# Altium project Main_board.PrjPcb
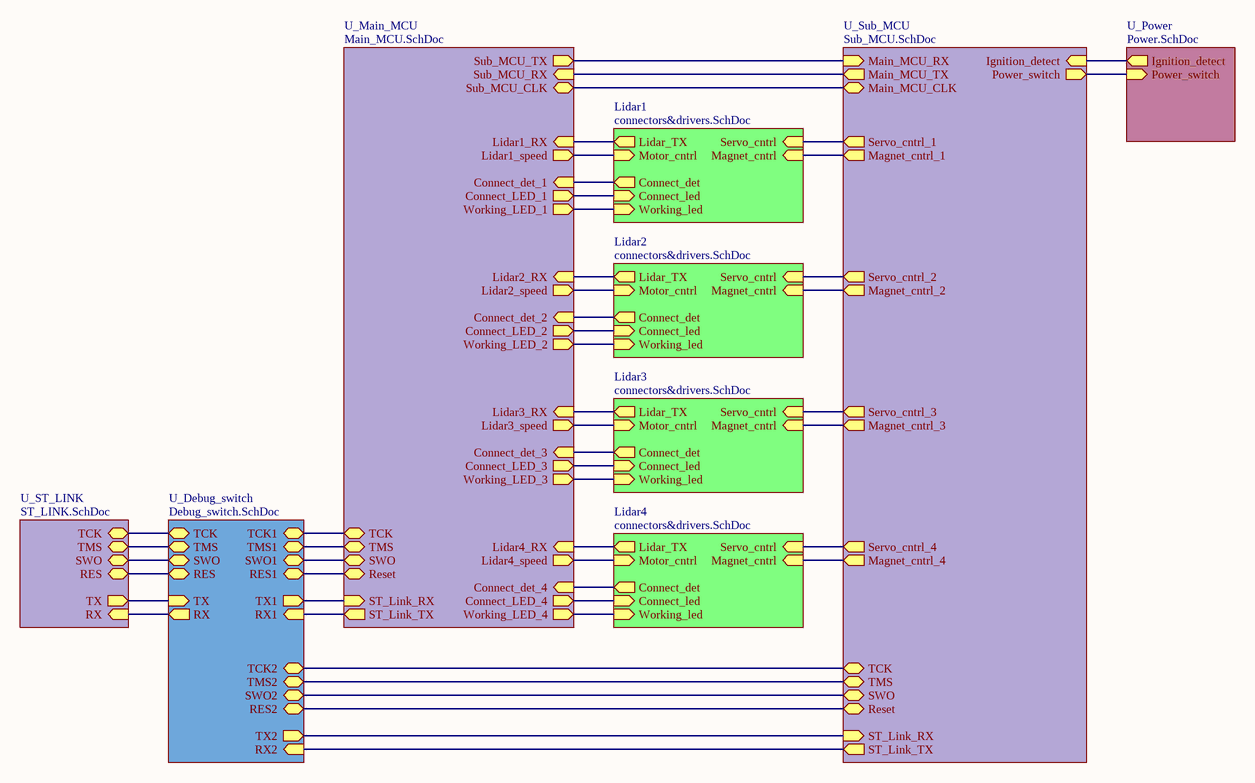
[diagram p0: Main_scheme.SchDoc]
7 sheets, 306 parts. Net scope: hierarchical (ports join the sheet entries above them; power ports are global).
Board file: PCB1.PcbDoc
Sheets:
  Main_scheme.SchDoc
    Lidar1 = connectors&drivers.SchDoc
    Lidar2 = connectors&drivers.SchDoc
    Lidar3 = connectors&drivers.SchDoc
    Lidar4 = connectors&drivers.SchDoc
    U_Main_MCU = Main_MCU.SchDoc
    U_Debug_switch = Debug_switch.SchDoc
    U_ST_LINK = ST_LINK.SchDoc
    U_Sub_MCU = Sub_MCU.SchDoc
    U_Power = Power.SchDoc

## Sheet Main_scheme.SchDoc
size A4; SheetNumber: 1; SheetTotal: 7

### Sub-sheets
Lidar1 = connectors&drivers.SchDoc: Servo_cntrl (in), Motor_cntrl (in), Magnet_cntrl (in), Lidar_TX (out), Connect_det (out), Connect_led (in), Working_led (in)
Lidar2 = connectors&drivers.SchDoc: Servo_cntrl (in), Motor_cntrl (in), Magnet_cntrl (in), Lidar_TX (out), Connect_det (out), Connect_led (in), Working_led (in)
Lidar3 = connectors&drivers.SchDoc: Servo_cntrl (in), Motor_cntrl (in), Magnet_cntrl (in), Lidar_TX (out), Connect_det (out), Connect_led (in), Working_led (in)
Lidar4 = connectors&drivers.SchDoc: Servo_cntrl (in), Motor_cntrl (in), Magnet_cntrl (in), Lidar_TX (out), Connect_det (out), Connect_led (in), Working_led (in)
U_Debug_switch = Debug_switch.SchDoc: SWO (bidir), RES (bidir), TMS (bidir), TCK (bidir), SWO1 (bidir), RES1 (bidir), SWO2 (bidir), RES2 (bidir), TMS1 (bidir), TCK1 (bidir), TMS2 (bidir), TCK2 (bidir), TX1 (out), RX1 (in), TX2 (out), RX2 (in), TX (in), RX (out)
U_Main_MCU = Main_MCU.SchDoc: TMS (bidir), TCK (bidir), SWO (bidir), Reset (bidir), Lidar1_RX (in), ST_Link_RX (in), ST_Link_TX (out), Lidar2_RX (in), Lidar3_RX (in), Lidar4_RX (in), Sub_MCU_RX (in), Sub_MCU_TX (out), Lidar1_speed (out), Lidar2_speed (out), Lidar4_speed (out), Lidar3_speed (out), Connect_det_1 (in), Connect_LED_1 (out), Working_LED_1 (out), Connect_det_2 (in), Connect_LED_2 (out), Working_LED_2 (out), Connect_det_3 (in), Connect_LED_3 (out), Working_LED_3 (out), Connect_det_4 (in), Connect_LED_4 (out), Working_LED_4 (out), Sub_MCU_CLK (bidir)
U_Power = Power.SchDoc: Ignition_detect (out), Power_switch (in)
U_ST_LINK = ST_LINK.SchDoc: SWO (bidir), RES (bidir), TMS (bidir), TCK (bidir), TX (out), RX (in)
U_Sub_MCU = Sub_MCU.SchDoc: TMS (bidir), TCK (bidir), SWO (bidir), Reset (bidir), Servo_cntrl_1 (out), Servo_cntrl_2 (out), Servo_cntrl_3 (out), Servo_cntrl_4 (out), Magnet_cntrl_1 (out), Magnet_cntrl_2 (out), Magnet_cntrl_3 (out), Magnet_cntrl_4 (out), ST_Link_RX (in), ST_Link_TX (out), Main_MCU_RX (in), Main_MCU_TX (out), Main_MCU_CLK (bidir), Ignition_detect (in), Power_switch (out)

### Nets
Connect_det_1: sheet Lidar1/Connect_det, sheet U_Main_MCU/Connect_det_1
Connect_det_2: sheet Lidar2/Connect_det, sheet U_Main_MCU/Connect_det_2
Connect_det_3: sheet Lidar3/Connect_det, sheet U_Main_MCU/Connect_det_3
Connect_det_4: sheet Lidar4/Connect_det, sheet U_Main_MCU/Connect_det_4
Connect_LED_1: sheet Lidar1/Connect_led, sheet U_Main_MCU/Connect_LED_1
Connect_LED_2: sheet Lidar2/Connect_led, sheet U_Main_MCU/Connect_LED_2
Connect_LED_3: sheet Lidar3/Connect_led, sheet U_Main_MCU/Connect_LED_3
Connect_LED_4: sheet Lidar4/Connect_led, sheet U_Main_MCU/Connect_LED_4
Ignition_detect: sheet U_Sub_MCU/Ignition_detect, sheet U_Power/Ignition_detect
Lidar1_RX: sheet Lidar1/Lidar_TX, sheet U_Main_MCU/Lidar1_RX
Lidar1_speed: sheet Lidar1/Motor_cntrl, sheet U_Main_MCU/Lidar1_speed
Lidar2_RX: sheet Lidar2/Lidar_TX, sheet U_Main_MCU/Lidar2_RX
Lidar2_speed: sheet Lidar2/Motor_cntrl, sheet U_Main_MCU/Lidar2_speed
Lidar3_RX: sheet Lidar3/Lidar_TX, sheet U_Main_MCU/Lidar3_RX
Lidar3_speed: sheet Lidar3/Motor_cntrl, sheet U_Main_MCU/Lidar3_speed
Lidar4_RX: sheet Lidar4/Lidar_TX, sheet U_Main_MCU/Lidar4_RX
Lidar4_speed: sheet Lidar4/Motor_cntrl, sheet U_Main_MCU/Lidar4_speed
Main_debug_RX: sheet U_Debug_switch/RX, sheet U_ST_LINK/RX
Main_debug_TX: sheet U_Debug_switch/TX, sheet U_ST_LINK/TX
Main_MCU_debug_RX: sheet U_Main_MCU/ST_Link_RX, sheet U_Debug_switch/TX1
Main_MCU_debug_TX: sheet U_Main_MCU/ST_Link_TX, sheet U_Debug_switch/RX1
Main_MCU_reset: sheet U_Main_MCU/Reset, sheet U_Debug_switch/RES1
Main_MCU_SWO: sheet U_Main_MCU/SWO, sheet U_Debug_switch/SWO1
Main_MCU_TCK: sheet U_Main_MCU/TCK, sheet U_Debug_switch/TCK1
Main_MCU_TMS: sheet U_Main_MCU/TMS, sheet U_Debug_switch/TMS1
Main_RES: sheet U_Debug_switch/RES, sheet U_ST_LINK/RES
Main_SWO: sheet U_Debug_switch/SWO, sheet U_ST_LINK/SWO
Main_TCK: sheet U_Debug_switch/TCK, sheet U_ST_LINK/TCK
Main_TMS: sheet U_Debug_switch/TMS, sheet U_ST_LINK/TMS
Power_switch: sheet U_Sub_MCU/Power_switch, sheet U_Power/Power_switch
Sub_MCU_CLK: sheet U_Main_MCU/Sub_MCU_CLK, sheet U_Sub_MCU/Main_MCU_CLK
Sub_MCU_debug_RX: sheet U_Debug_switch/TX2, sheet U_Sub_MCU/ST_Link_RX
Sub_MCU_debug_TX: sheet U_Debug_switch/RX2, sheet U_Sub_MCU/ST_Link_TX
Sub_MCU_RES: sheet U_Debug_switch/RES2, sheet U_Sub_MCU/Reset
Sub_MCU_RX: sheet U_Main_MCU/Sub_MCU_RX, sheet U_Sub_MCU/Main_MCU_TX
Sub_MCU_SWO: sheet U_Debug_switch/SWO2, sheet U_Sub_MCU/SWO
Sub_MCU_TCK: sheet U_Debug_switch/TCK2, sheet U_Sub_MCU/TCK
Sub_MCU_TMS: sheet U_Debug_switch/TMS2, sheet U_Sub_MCU/TMS
Sub_MCU_TX: sheet U_Main_MCU/Sub_MCU_TX, sheet U_Sub_MCU/Main_MCU_RX
Working_LED_1: sheet Lidar1/Working_led, sheet U_Main_MCU/Working_LED_1
Working_LED_2: sheet Lidar2/Working_led, sheet U_Main_MCU/Working_LED_2
Working_LED_3: sheet Lidar3/Working_led, sheet U_Main_MCU/Working_LED_3
Working_LED_4: sheet Lidar4/Working_led, sheet U_Main_MCU/Working_LED_4
NetIC601_1_2: sheet Lidar1/Servo_cntrl, sheet U_Sub_MCU/Servo_cntrl_1
NetIC601_2_2: sheet Lidar2/Servo_cntrl, sheet U_Sub_MCU/Servo_cntrl_2
NetIC601_3_2: sheet Lidar3/Servo_cntrl, sheet U_Sub_MCU/Servo_cntrl_3
NetIC601_4_2: sheet Lidar4/Servo_cntrl, sheet U_Sub_MCU/Servo_cntrl_4
NetU300_18: sheet Lidar3/Magnet_cntrl, sheet U_Sub_MCU/Magnet_cntrl_3
NetU300_19: sheet Lidar4/Magnet_cntrl, sheet U_Sub_MCU/Magnet_cntrl_4
NetU300_40: sheet Lidar1/Magnet_cntrl, sheet U_Sub_MCU/Magnet_cntrl_1
NetU300_41: sheet Lidar2/Magnet_cntrl, sheet U_Sub_MCU/Magnet_cntrl_2

## Sheet connectors&drivers.SchDoc
size A4; SheetNumber: 7; SheetTotal: 7
Used 4 times, as channels Lidar1, Lidar2, Lidar3, Lidar4. Parts and nets are listed once, with the designators drawn on the sheet.
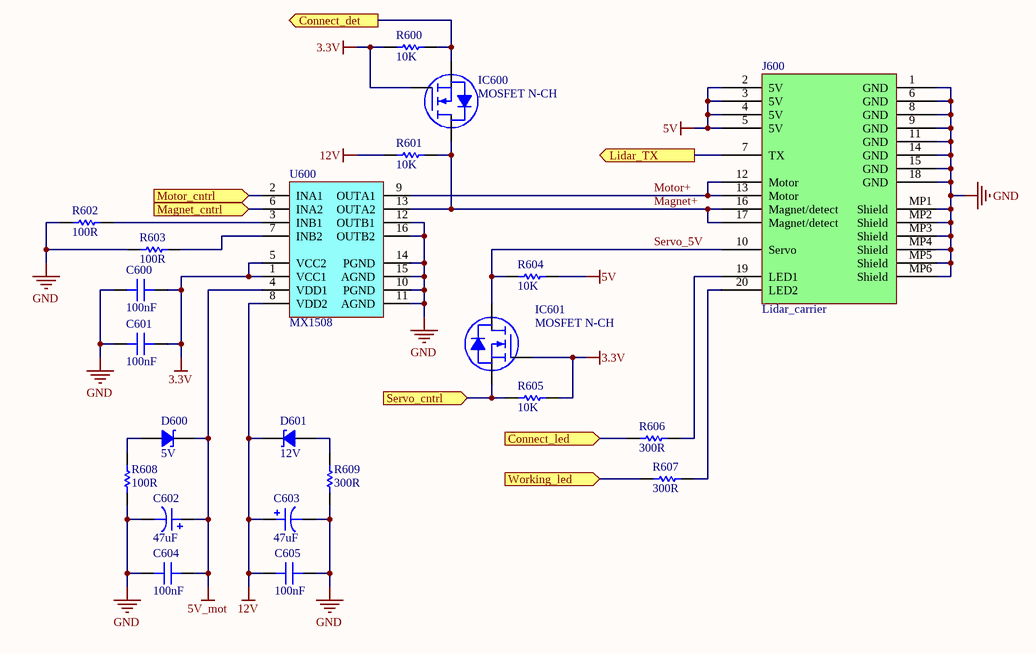
[diagram p1: connectors&drivers.SchDoc]

### Parts
C600  100nF  [CAP 0603]
C601  100nF  [CAP 0603]
C602  47uF  [CAP ALSMD ELEC 6.6MM H5.7MM]
C603  47uF  [CAP ALSMD ELEC 6.6MM H5.7MM]
C604  100nF  [CAP 0603]
C605  100nF  [CAP 0603]
D600  5V  [Bourns DO214AC SMA]
D601  12V  [Bourns DO214AC SMA]
IC600  MOSFET N-CH  [SOT-23]
IC601  MOSFET N-CH  [SOT-23]
J600  Lidar_carrier  [2167010209]
R600  10K  [RES 0603]
R601  10K  [RES 0603]
R602  100R  [RES 0603]
R603  100R  [RES 0603]
R604  10K  [RES 0603]
R605  10K  [RES 0603]
R606  300R  [RES 0603]
R607  300R  [RES 0603]
R608  100R  [RES 1206]
R609  300R  [RES 1206]
U600  MX1508  [TI SOP-16 D]

### Ports
Connect_det (out, see Main_scheme[2B]), Connect_led (in, see Main_scheme[2B]), Lidar_TX (out, see Main_scheme[2A]), Magnet_cntrl (in, see Main_scheme[3A]), Motor_cntrl (in, see Main_scheme[2A]), Servo_cntrl (in, see Main_scheme[3A]), Working_led (in, see Main_scheme[2B])

### Nets
3.3V: C600.2 C601.2 IC600.1(G) IC601.1(G) R600.2 R605.1 U600.1(VCC1) U600.5(VCC2)
5V: J600.2(5V) J600.3(5V) J600.4(5V) J600.5(5V) R604.1
5V_mot: C602.2 C604.2 D600.2 U600.4(VDD1)
12V: C603.2 C605.1 D601.2 R601.2 U600.8(VDD2)
GND: C600.1 C601.1 C602.1 C603.1 C604.1 C605.2 J600.1(GND) J600.6(GND) J600.8(GND) J600.9(GND) J600.11(GND) J600.14(GND) J600.15(GND) J600.18(GND) J600.MP1(Shield) J600.MP2(Shield) J600.MP3(Shield) J600.MP4(Shield) J600.MP5(Shield) J600.MP6(Shield) R602.1 R603.1 R608.1 R609.1 U600.10(PGND) U600.11(AGND) U600.12(OUTB1) U600.14(PGND) U600.15(AGND) U600.16(OUTB2)
Connect_det: IC600.2(S) R600.1 ; port Connect_det
Connect_led: R606.2 ; port Connect_led
Lidar_TX: J600.7(TX) ; port Lidar_TX
Magnet+: IC600.3(D) J600.16(Magnet/detect) J600.17(Magnet/detect) R601.1 U600.13(OUTA2)
Magnet_cntrl: U600.6(INA2) ; port Magnet_cntrl
Motor+: J600.12(Motor) J600.13(Motor) U600.9(OUTA1)
Motor_cntrl: U600.2(INA1) ; port Motor_cntrl
Servo_5V: IC601.3(D) J600.10(Servo) R604.2
Servo_cntrl: IC601.2(S) R605.2 ; port Servo_cntrl
Working_led: R607.2 ; port Working_led
NetD600_1: D600.1 R608.2
NetD601_1: D601.1 R609.2
NetJ600_19: J600.19(LED1) R606.1
NetJ600_20: J600.20(LED2) R607.1
NetR602_2: R602.2 U600.3(INB1)
NetR603_2: R603.2 U600.7(INB2)

### Channels
Lidar1: designators end in _1; ports Connect_det=Connect_det_1 Connect_led=Connect_LED_1 Lidar_TX=Lidar1_RX Magnet_cntrl=NetU300_40 Motor_cntrl=Lidar1_speed Servo_cntrl=NetIC601_1_2 Working_led=Working_LED_1
Lidar2: designators end in _2; ports Connect_det=Connect_det_2 Connect_led=Connect_LED_2 Lidar_TX=Lidar2_RX Magnet_cntrl=NetU300_41 Motor_cntrl=Lidar2_speed Servo_cntrl=NetIC601_2_2 Working_led=Working_LED_2
Lidar3: designators end in _3; ports Connect_det=Connect_det_3 Connect_led=Connect_LED_3 Lidar_TX=Lidar3_RX Magnet_cntrl=NetU300_18 Motor_cntrl=Lidar3_speed Servo_cntrl=NetIC601_3_2 Working_led=Working_LED_3
Lidar4: designators end in _4; ports Connect_det=Connect_det_4 Connect_led=Connect_LED_4 Lidar_TX=Lidar4_RX Magnet_cntrl=NetU300_19 Motor_cntrl=Lidar4_speed Servo_cntrl=NetIC601_4_2 Working_led=Working_LED_4

### Library data of the parts
C600 C601 C604 C605 = Capacitor: SMT Capacitor; Value: 100nF
C602 C603 = Capacitor polarized: SMT Polarised Capacitor; Value: 47uF
D600 D601 = Diode Zener: Zener Diode
  D600: Value: 5V
  D601: Value: 12V
R600-R609 = Res: Resistor; Ordered by: Subcon; Published: 8-Jun-2000; Revision: July-2002: Re-released for DXP Platform.; Publisher: Altium Limited
  R600 R601 R604 R605: Value: 10K
  R602 R603 R608: Value: 100R
  R606 R607 R609: Value: 300R

## Sheet Main_MCU.SchDoc
size A4; SheetNumber: 3; SheetTotal: 7
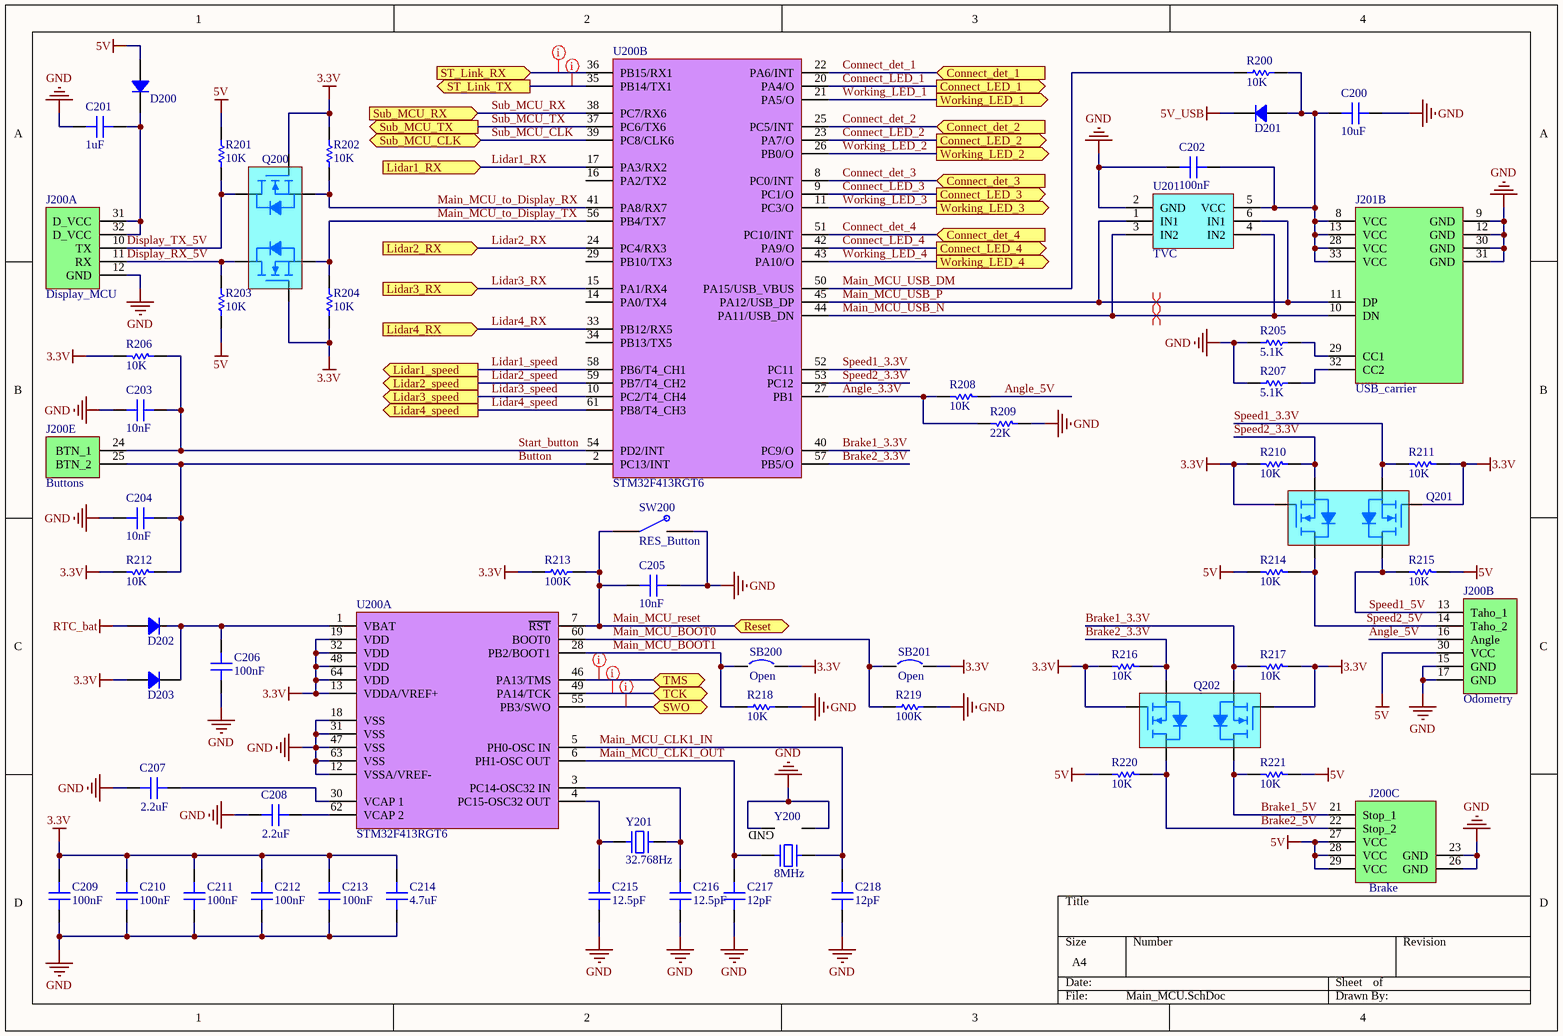
[diagram p2: Main_MCU.SchDoc]

### Parts
C200  10uF  [CAP 0603]
C201  1uF  [CAP 0603]
C202  100nF  [CAP 0603]
C203  10nF  [CAP 0603]
C204  10nF  [CAP 0603]
C205  10nF  [CAP 0603]
C206  100nF  [CAP 0603]
C207  2.2uF  [CAP 0603]
C208  2.2uF  [CAP 0603]
C209  100nF  [CAP 0603]
C210  100nF  [CAP 0603]
C211  100nF  [CAP 0603]
C212  100nF  [CAP 0603]
C213  100nF  [CAP 0603]
C214  4.7uF  [CAP 1206]
C215  12.5pF  [CAP 0603]
C216  12.5pF  [CAP 0603]
C217  12pF  [CAP 0603]
C218  12pF  [CAP 0603]
D200  (no value)  [Bourns DO214AC SMA - duplicate]
D201  (no value)  [Bourns DO214AC SMA - duplicate]
D202  (no value)  [SOD323HP]
D203  (no value)  [SOD323HP]
J200  Display_MCU  [2167010409]  (parts A,B,C,E of 6)
J201  USB_carrier  [2167010409]  (part B of 4)
Q200  Double N mos  [TI SOT-563 DRL]  (value not drawn)
Q201  Double N mos  [TI SOT-563 DRL]  (value not drawn)
Q202  Double N mos  [TI SOT-563 DRL]  (value not drawn)
R200  10K  [RES 0603]
R201  10K  [RES 0603]
R202  10K  [RES 0603]
R203  10K  [RES 0603]
R204  10K  [RES 0603]
R205  5.1K  [RES 0603]
R206  10K  [RES 0603]
R207  5.1K  [RES 0603]
R208  10K  [RES 0603]
R209  22K  [RES 0603]
R210  10K  [RES 0603]
R211  10K  [RES 0603]
R212  10K  [RES 0603]
R213  100K  [RES 0603]
R214  10K  [RES 0603]
R215  10K  [RES 0603]
R216  10K  [RES 0603]
R217  10K  [RES 0603]
R218  10K  [RES 0603]
R219  100K  [RES 0603]
R220  10K  [RES 0603]
R221  10K  [RES 0603]
SB200  Open  [SB_0603]
SB201  Open  [SB_0603]
SW200  RES_Button  [PTS636SM50JSMTRLFS]
U200  STM32F413RGT6  [QFP50P1200X1200X165-64N]  (parts A,B of 2)
U201  TVC  [DIODES SOT-23-6 W6]
Y200  8MHz  [XTAL_ECS-80-10-33-CHN-TR3]
Y201  32.768Hz  [Crystal_32.768]

### Ports
Connect_det_1 (in, see Main_scheme[2B]), Connect_det_2 (in, see Main_scheme[2B]), Connect_det_3 (in, see Main_scheme[2C]), Connect_det_4 (in, see Main_scheme[2C]), Connect_LED_1 (out, see Main_scheme[2B]), Connect_LED_2 (out, see Main_scheme[2B]), Connect_LED_3 (out, see Main_scheme[2C]), Connect_LED_4 (out, see Main_scheme[2C]), Lidar1_RX (in, see Main_scheme[2A]), Lidar1_speed (out, see Main_scheme[2A]), Lidar2_RX (in, see Main_scheme[2B]), Lidar2_speed (out, see Main_scheme[2B]), Lidar3_RX (in, see Main_scheme[2B]), Lidar3_speed (out, see Main_scheme[2C]), Lidar4_RX (in, see Main_scheme[2C]), Lidar4_speed (out, see Main_scheme[2C]), Reset (bidir, see Main_scheme[1C]), ST_Link_RX (in, see Main_scheme[1C]), ST_Link_TX (out, see Main_scheme[1C]), Sub_MCU_CLK (bidir, see Main_scheme[2A]), Sub_MCU_RX (in, see Main_scheme[2A]), Sub_MCU_TX (out, see Main_scheme[2A]), SWO (bidir, see Main_scheme[1C]), TCK (bidir, see Main_scheme[1C]), TMS (bidir, see Main_scheme[1C]), Working_LED_1 (out, see Main_scheme[2B]), Working_LED_2 (out, see Main_scheme[2B]), Working_LED_3 (out, see Main_scheme[2C]), Working_LED_4 (out, see Main_scheme[2C])

### Nets
3.3V: C209.2 C210.2 C211.2 C212.2 C213.2 C214.2 D203.1 Q200.1(G2) Q200.4(G1) Q201.1(G2) Q201.4(G1) Q202.1(G2) Q202.4(G1) R202.2 R204.1 R206.1 R210.1 R211.2 R212.1 R213.2 R216.1 R217.2 SB200.2 SB201.2 U200.13(VDDA/VREF+) U200.19(VDD) U200.32(VDD) U200.48(VDD) U200.64(VDD)
5V: D200.1 J200.27(VCC) J200.28(VCC) J200.29(VCC) J200.30(VCC) R201.2 R203.1 R214.1 R215.2 R220.1 R221.2
5V_USB: D201.2
GND: C200.2 C201.1 C202.1 C203.2 C204.2 C205.2 C206.1 C207.2 C208.2 C209.1 C210.1 C211.1 C212.1 C213.1 C214.1 C215.1 C216.1 C217.1 C218.1 J200.12(GND) J200.15(GND) J200.17(GND) J200.23(GND) J200.26(GND) J201.9(GND) J201.12(GND) J201.30(GND) J201.31(GND) R205.1 R207.1 R209.2 R218.1 R219.1 SW200.2 U200.12(VSSA/VREF-) U200.18(VSS) U200.31(VSS) U200.47(VSS) U200.63(VSS) U201.2(GND) Y200.2(GND) Y200.4(GND)
RTC_bat: D202.1
Angle_3.3V: R208.1 R209.1 U200.27(PB1)
Angle_5V: J200.16(Angle) R208.2
Brake1_3.3V: Q202.5(S1) R217.1 U200.40(PC9/O)
Brake1_5V: J200.21(Stop_1) Q202.3(D1) R221.1
Brake2_3.3V: Q202.2(S2) R216.2 U200.57(PB5/O)
Brake2_5V: J200.22(Stop_2) Q202.6(D2) R220.2
Button: C204.1 J200.25(BTN_2) R212.2 U200.2(PC13/INT)
Connect_det_1: U200.22(PA6/INT) ; port Connect_det_1
Connect_det_2: U200.25(PC5/INT) ; port Connect_det_2
Connect_det_3: U200.8(PC0/INT) ; port Connect_det_3
Connect_det_4: U200.51(PC10/INT) ; port Connect_det_4
Connect_LED_1: U200.20(PA4/O) ; port Connect_LED_1
Connect_LED_2: U200.23(PA7/O) ; port Connect_LED_2
Connect_LED_3: U200.9(PC1/O) ; port Connect_LED_3
Connect_LED_4: U200.42(PA9/O) ; port Connect_LED_4
Display_RX_5V: J200.11(RX) Q200.3(D1) R203.2
Display_TX_5V: J200.10(TX) Q200.6(D2) R201.1
Lidar1_RX: U200.17(PA3/RX2) ; port Lidar1_RX
Lidar1_speed: U200.58(PB6/T4_CH1) ; port Lidar1_speed
Lidar2_RX: U200.24(PC4/RX3) ; port Lidar2_RX
Lidar2_speed: U200.59(PB7/T4_CH2) ; port Lidar2_speed
Lidar3_RX: U200.15(PA1/RX4) ; port Lidar3_RX
Lidar3_speed: U200.10(PC2/T4_CH4) ; port Lidar3_speed
Lidar4_RX: U200.33(PB12/RX5) ; port Lidar4_RX
Lidar4_speed: U200.61(PB8/T4_CH3) ; port Lidar4_speed
Main_MCU_BOOT0: R219.2 SB201.1 U200.60(BOOT0)
Main_MCU_BOOT1: R218.2 SB200.1 U200.28(PB2/BOOT1)
Main_MCU_CLK1_IN: C218.2 U200.5(PH0-OSC_IN) Y200.3
Main_MCU_CLK1_OUT: C217.2 U200.6(PH1-OSC_OUT) Y200.1
Main_MCU_debug_RX: U200.36(PB15/RX1) ; port ST_Link_RX
Main_MCU_debug_TX: U200.35(PB14/TX1) ; port ST_Link_TX
Main_MCU_reset: C205.1 R213.1 SW200.1 U200.7(~{RST}) ; port Reset
Main_MCU_SWO: U200.55(PB3/SWO) ; port SWO
Main_MCU_TCK: U200.49(PA14/TCK) ; port TCK
Main_MCU_TMS: U200.46(PA13/TMS) ; port TMS
Main_MCU_to_Display_RX: Q200.2(S2) R202.1 U200.41(PA8/RX7)
Main_MCU_to_Display_TX: Q200.5(S1) R204.2 U200.56(PB4/TX7)
Main_MCU_USB_DM: R200.2 U200.50(PA15/USB_VBUS)
Main_MCU_USB_N: J201.10(DN) U200.44(PA11/USB_DN) U201.3(IN2) U201.4(IN2)
Main_MCU_USB_P: J201.11(DP) U200.45(PA12/USB_DP) U201.1(IN1) U201.6(IN1)
Speed1_3.3V: Q201.5(S1) R211.1 U200.52(PC11)
Speed1_5V: J200.13(Taho_1) Q201.3(D1) R215.1
Speed2_3.3V: Q201.2(S2) R210.2 U200.53(PC12)
Speed2_5V: J200.14(Taho_2) Q201.6(D2) R214.2
Start_button: C203.1 J200.24(BTN_1) R206.2 U200.54(PD2/INT)
Sub_MCU_CLK: U200.39(PC8/CLK6) ; port Sub_MCU_CLK
Sub_MCU_RX: U200.38(PC7/RX6) ; port Sub_MCU_RX
Sub_MCU_TX: U200.37(PC6/TX6) ; port Sub_MCU_TX
Working_LED_1: U200.21(PA5/O) ; port Working_LED_1
Working_LED_2: U200.26(PB0/O) ; port Working_LED_2
Working_LED_3: U200.11(PC3/O) ; port Working_LED_3
Working_LED_4: U200.43(PA10/O) ; port Working_LED_4
NetC200_1: C200.1 C202.2 D201.1 J201.8(VCC) J201.13(VCC) J201.28(VCC) J201.33(VCC) R200.1 U201.5(VCC)
NetC201_2: C201.2 D200.2 J200.31(D_VCC) J200.32(D_VCC)
NetC206_2: C206.2 D202.2 D203.2 U200.1(VBAT)
NetC207_1: C207.1 U200.30(VCAP_1)
NetC208_1: C208.1 U200.62(VCAP_2)
NetC215_2: C215.2 U200.4(PC15-OSC32_OUT) Y201.1
NetC216_2: C216.2 U200.3(PC14-OSC32_IN) Y201.2
NetJ201_29: J201.29(CC1) R205.2
NetJ201_32: J201.32(CC2) R207.2

Not connected (* = marked no-connect by the designer): U200 14(PA0/TX4) 16(PA2/TX2) 29(PB10/TX3) 34(PB13/TX5)

### Layout directives
differential pair: Main_MCU_USB_N, Main_MCU_USB_P
net class Main_MCU_SWD: Main_MCU_SWO, Main_MCU_TCK, Main_MCU_TMS
net class Main_MCU_UART: Main_MCU_debug_RX, Main_MCU_debug_TX

### Library data of the parts
C200-C218 = Capacitor: SMT Capacitor
  C200: Value: 10uF
  C201: Value: 1uF
  C202 C206 C209-C213: Value: 100nF
  C203-C205: Value: 10nF
  C207 C208: Value: 2.2uF
  C214: Value: 4.7uF
  C215 C216: Value: 12.5pF
  C217 C218: Value: 12pF
D200-D203 = Diode: Rectifier Diode
J200 = AUX_carrier
R200-R221 = Res: Resistor; Ordered by: Subcon; Published: 8-Jun-2000; Revision: July-2002: Re-released for DXP Platform.; Publisher: Altium Limited
  R200-R204 R206 R208 R210-R212 R214-R218 R220 R221: Value: 10K
  R205 R207: Value: 5.1K
  R209: Value: 22K
  R213 R219: Value: 100K
SB200 SB201 = Circuit Breaker: Published: 24-Mar-1999; Revision: July-2002: Re-released for DXP Platform.; Publisher: Altium Limited
U200 = CMP-12105-000025-1: IC MCU 32BIT 1MB FLASH 64LQFP; Manufacturer: STMicroelectronics; Max Supply Voltage: 3.6V; Number Of Uart Channels: 7; Data Bus Width: 32bits; Number Of Pwm Channels: 32; Max Junction Temp: +105°C; Number Of A/D Converters: 1; Core Architecture: ARM Cortex-M4; Number Of Timers/Counters: 15; Min Supply Voltage: 1.7V; Memory Size: 1MBytes; Standoff Height: 0.05mm; Number Of Spi Channels: 5; Number Of Adc Channels: 16; Number Of I2C Channels: 4; Ram Size: 320KBytes; Interface: I2C,SPI,UART,USART,CAN,USB,LIN,IrDA,I2S,Other; Frequency: 100MHz; Number Of I/Os: 50; Nominal Supply Current: 25-180mA; Ambient Temperature Range High: +85°C; Ipc Land Pattern Name: QFP50P1200X1200X160-64; Temperature Range High: +105°C; Lead Free: Yes; Ambient Temperature Range Low: -40°C; Digikey Description: IC MCU 32BIT 1MB FLASH 64LQFP; Device Class L3: Microcontrollers; Temperature: -40°C to +105°C; Temperature Range Low: -40°C; Number Of Cores: 1; ComponentLink2Description: Datasheet; Category: IC; Device Class L1: Integrated Circuits (ICs); Package: LQFP64-5W; Height: 1.6mm; ComponentLink2URL: http://www.st.com/content/ccc/resource/technical/document/datasheet/group3/f6/1d/4a/d9/f9/96/43/2a/DM00282249/files/DM00282249.pdf/jcr:content/translations/en.DM00282249.pdf; Manufacturer Part Number: STM32F413RGT6; RoHS: TRUE; Memory Type: FLASH; Number Of Usb Channels: 1; Device Class L2: Embedded Processors and Controllers; Automotive: No; Octopart: https://octopart.com/stm32f413rgt6-stmicroelectronics-76512522
U201 = USB_TVC_protection
Y200 = Crystal 8Mhz: SMT Crystal; Value: 8MHz
Y201 = Crystal_32.768Hz: SMT Crystal; Value: 32.768Hz

## Sheet Debug_switch.SchDoc
size A4; SheetNumber: 6; SheetTotal: 7
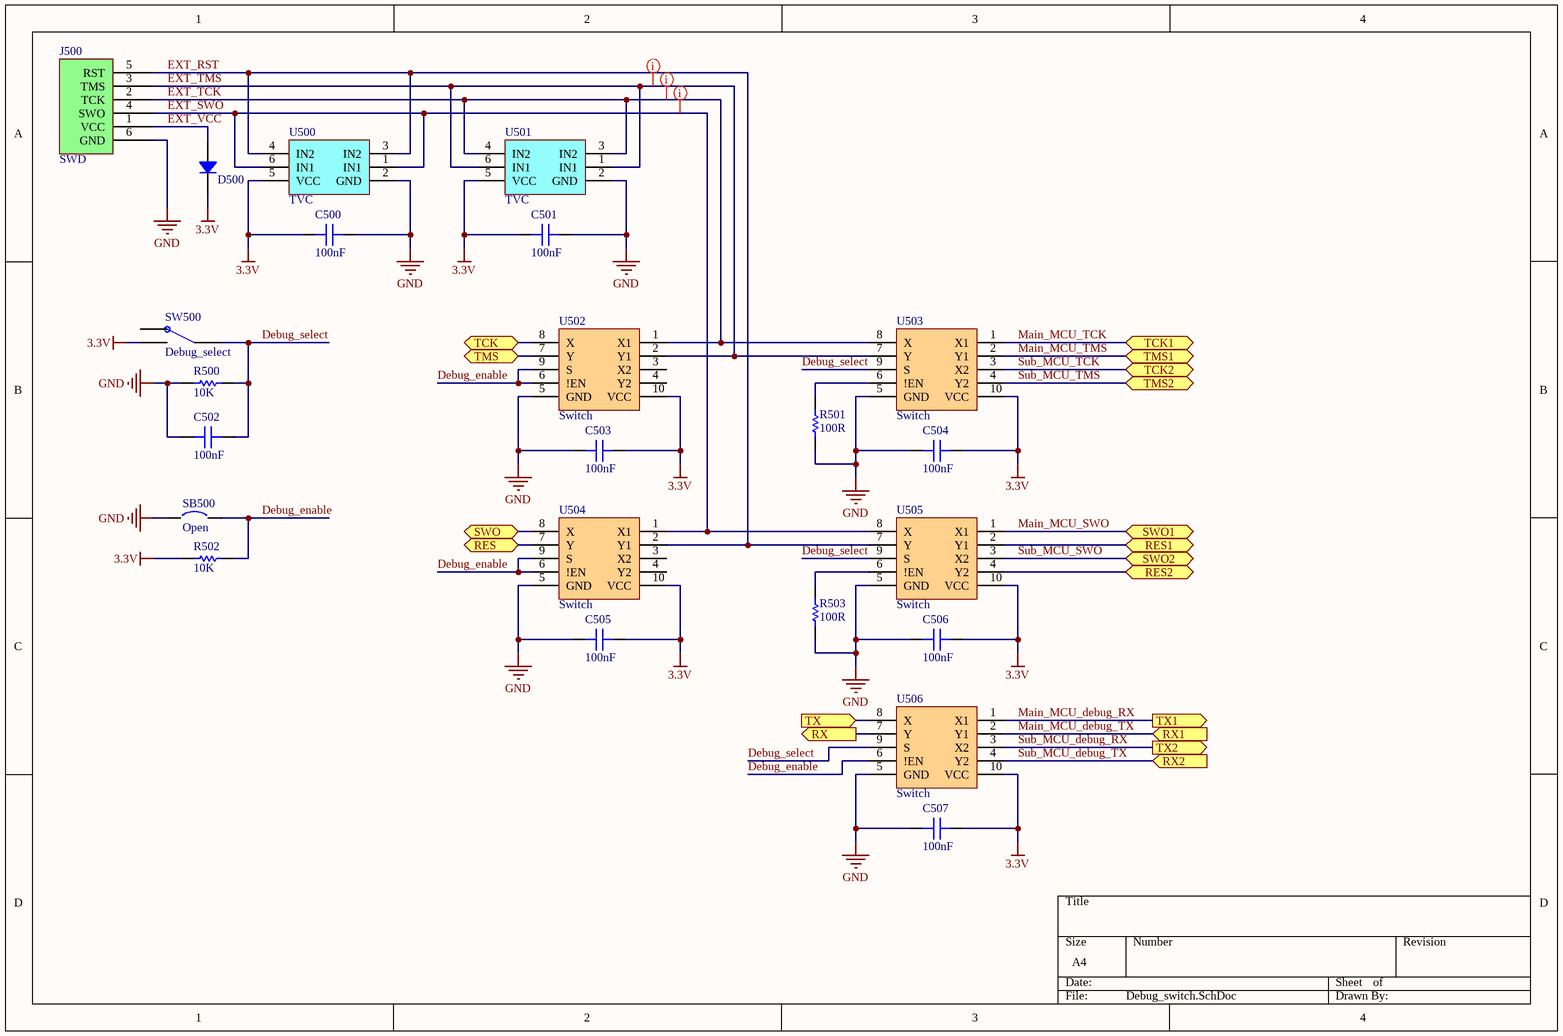
[diagram p3: Debug_switch.SchDoc]

### Parts
C500  100nF  [CAP 0603]
C501  100nF  [CAP 0603]
C502  100nF  [CAP 0603]
C503  100nF  [CAP 0603]
C504  100nF  [CAP 0603]
C505  100nF  [CAP 0603]
C506  100nF  [CAP 0603]
C507  100nF  [CAP 0603]
D500  (no value)  [Bourns DO214AC SMA - duplicate]
J500  SWD  [AMPHENOL_20021121-00006C1LF]
R500  10K  [RES 0603]
R501  100R  [RES 0603]
R502  10K  [RES 0603]
R503  100R  [RES 0603]
SB500  Open  [SB_0603]
SW500  Debug_select  [SW_JS202011JCQN]
U500  TVC  [SOT95P275X110-6N - duplicate - duplicate]
U501  TVC  [SOT95P275X110-6N - duplicate - duplicate]
U502  Switch  [PI3USB221AZUAEX]
U503  Switch  [PI3USB221AZUAEX]
U504  Switch  [PI3USB221AZUAEX]
U505  Switch  [PI3USB221AZUAEX]
U506  Switch  [PI3USB221AZUAEX]

### Ports
RES1 (bidir, see Main_scheme[1C]), RES2 (bidir, see Main_scheme[1D]), RES (bidir, see Main_scheme[1C], ST_LINK[2B]), RX1 (in, see Main_scheme[1C]), RX2 (in, see Main_scheme[1D]), RX (out, see Main_scheme[1C], ST_LINK[2B]), SWO1 (bidir, see Main_scheme[1C]), SWO2 (bidir, see Main_scheme[1D]), SWO (bidir, see Main_scheme[1C], ST_LINK[2B]), TCK1 (bidir, see Main_scheme[1C]), TCK2 (bidir, see Main_scheme[1C]), TCK (bidir, see Main_scheme[1C], ST_LINK[2B]), TMS1 (bidir, see Main_scheme[1C]), TMS2 (bidir, see Main_scheme[1D]), TMS (bidir, see Main_scheme[1C], ST_LINK[3B]), TX1 (out, see Main_scheme[1C]), TX2 (out, see Main_scheme[1D]), TX (in, see Main_scheme[1C], ST_LINK[2B])

### Nets
3.3V: C500.1 C501.1 C503.2 C504.2 C505.2 C506.2 C507.2 D500.2 R502.1 SW500.3 U500.5(VCC) U501.5(VCC) U502.10(VCC) U503.10(VCC) U504.10(VCC) U505.10(VCC) U506.10(VCC)
GND: C500.2 C501.2 C502.1 C503.1 C504.1 C505.1 C506.1 C507.1 J500.6(GND) R500.1 R501.1 R503.1 SB500.1 U500.2(GND) U501.2(GND) U502.5(GND) U503.5(GND) U504.5(GND) U505.5(GND) U506.5(GND)
Debug_enable: R502.2 SB500.2 U502.6(!EN) U502.9(S) U504.6(!EN) U504.9(S) U506.6(!EN)
Debug_select: C502.2 R500.2 SW500.2 U503.9(S) U505.9(S) U506.9(S)
EXT_RST: J500.5(RST) U500.3(IN2) U500.4(IN2) U504.2(Y1) U505.7(Y)
EXT_SWO: J500.4(SWO) U500.1(IN1) U500.6(IN1) U504.1(X1) U505.8(X)
EXT_TCK: J500.2(TCK) U501.3(IN2) U501.4(IN2) U502.1(X1) U503.8(X)
EXT_TMS: J500.3(TMS) U501.1(IN1) U501.6(IN1) U502.2(Y1) U503.7(Y)
EXT_VCC: D500.1 J500.1(VCC)
Main_debug_RX: U506.7(Y) ; port RX
Main_debug_TX: U506.8(X) ; port TX
Main_MCU_debug_RX: U506.1(X1) ; port TX1
Main_MCU_debug_TX: U506.2(Y1) ; port RX1
Main_MCU_reset: U505.2(Y1) ; port RES1
Main_MCU_SWO: U505.1(X1) ; port SWO1
Main_MCU_TCK: U503.1(X1) ; port TCK1
Main_MCU_TMS: U503.2(Y1) ; port TMS1
Main_RES: U504.7(Y) ; port RES
Main_SWO: U504.8(X) ; port SWO
Main_TCK: U502.8(X) ; port TCK
Main_TMS: U502.7(Y) ; port TMS
Sub_MCU_debug_RX: U506.3(X2) ; port TX2
Sub_MCU_debug_TX: U506.4(Y2) ; port RX2
Sub_MCU_RES: U505.4(Y2) ; port RES2
Sub_MCU_SWO: U505.3(X2) ; port SWO2
Sub_MCU_TCK: U503.3(X2) ; port TCK2
Sub_MCU_TMS: U503.4(Y2) ; port TMS2
NetR501_2: R501.2 U503.6(!EN)
NetR503_2: R503.2 U505.6(!EN)

Not connected (* = marked no-connect by the designer): SW500 1; U502 3(X2) 4(Y2); U504 3(X2) 4(Y2)

### Layout directives
net class EXT_SWD: EXT_SWO, EXT_TCK, EXT_TMS

### Library data of the parts
C500-C507 = Capacitor: SMT Capacitor; Value: 100nF
D500 = Diode: Rectifier Diode
J500 = SWD_connector
R500-R503 = Res: Resistor; Ordered by: Subcon; Published: 8-Jun-2000; Revision: July-2002: Re-released for DXP Platform.; Publisher: Altium Limited
  R500 R502: Value: 10K
  R501 R503: Value: 100R
SB500 = Circuit Breaker: Published: 24-Mar-1999; Revision: July-2002: Re-released for DXP Platform.; Publisher: Altium Limited
SW500 = Switch_1
U500 U501 = TVC_protection

## Sheet ST_LINK.SchDoc
size A4; SheetNumber: 5; SheetTotal: 7
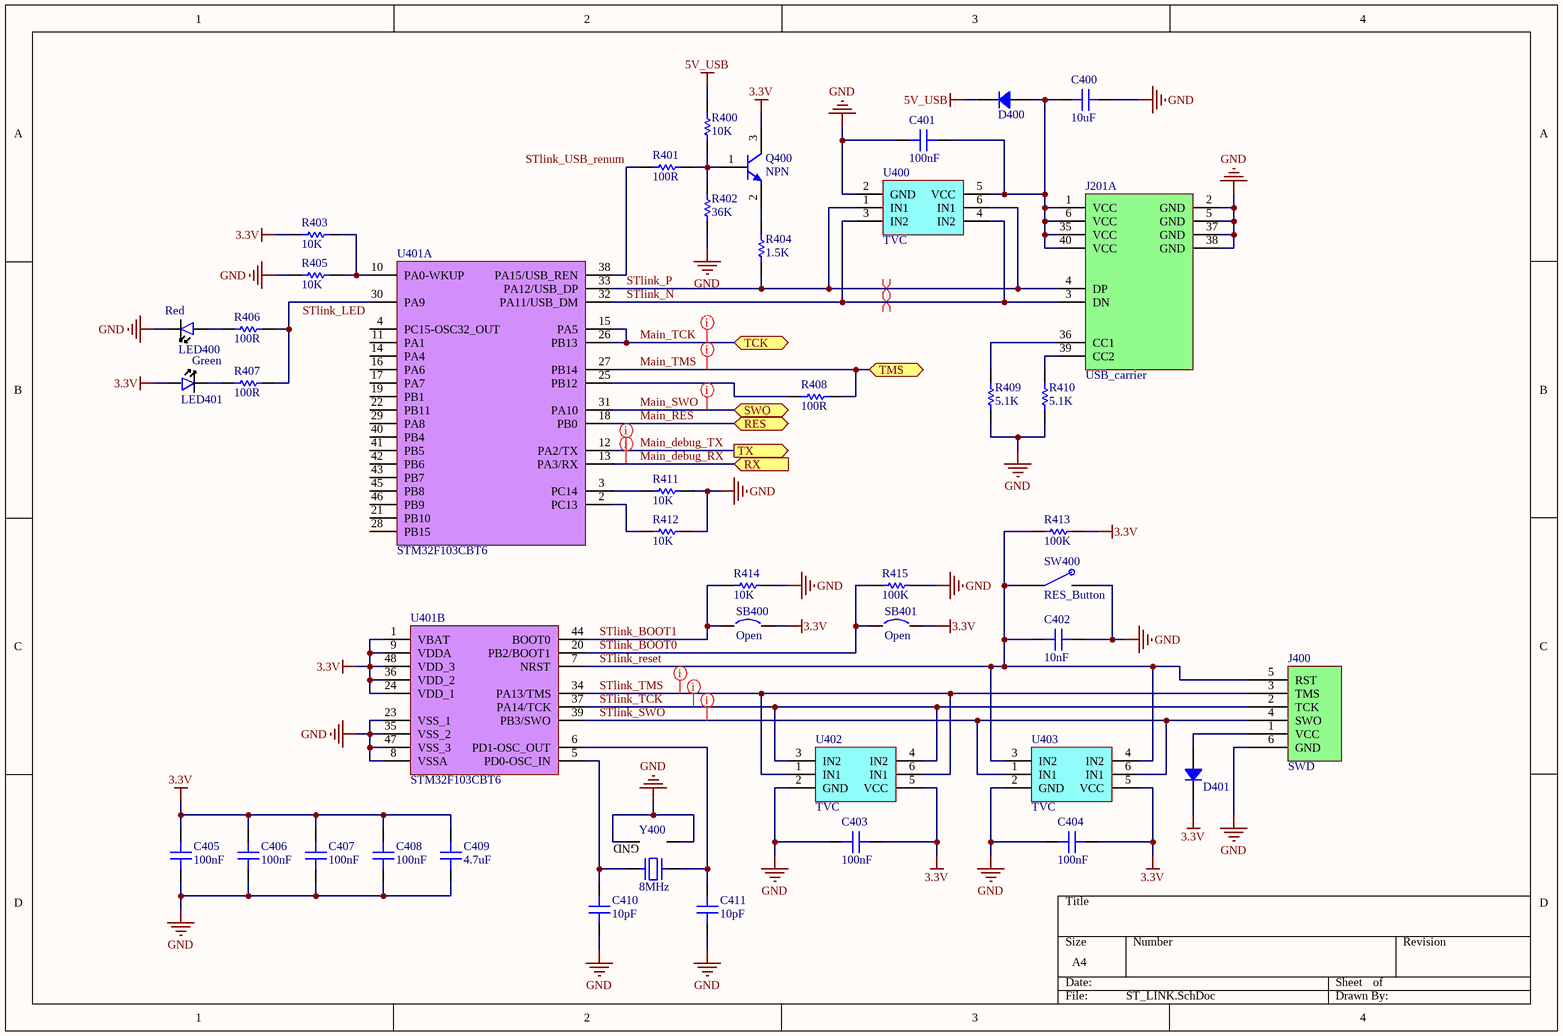
[diagram p4: ST_LINK.SchDoc]

### Parts
C400  10uF  [CAP 0603]
C401  100nF  [CAP 0603]
C402  10nF  [CAP 0603]
C403  100nF  [CAP 0603]
C404  100nF  [CAP 0603]
C405  100nF  [CAP 0603]
C406  100nF  [CAP 0603]
C407  100nF  [CAP 0603]
C408  100nF  [CAP 0603]
C409  4.7uF  [CAP 1206]
C410  10pF  [CAP 0603]
C411  10pF  [CAP 0603]
D400  (no value)  [Bourns DO214AC SMA - duplicate]
D401  (no value)  [Bourns DO214AC SMA - duplicate]
J201  USB_carrier  [2167010409]  (part A of 4)
J400  SWD  [AMPHENOL_20021121-00006C1LF]
LED400  Red  [LED_0603]
LED401  Green  [LED_0603]
Q400  NPN  [SOT-23]
R400  10K  [RES 0603]
R401  100R  [RES 0603]
R402  36K  [RES 0603]
R403  10K  [RES 0603]
R404  1.5K  [RES 0603]
R405  10K  [RES 0603]
R406  100R  [RES 0603]
R407  100R  [RES 0603]
R408  100R  [RES 0603]
R409  5.1K  [RES 0603]
R410  5.1K  [RES 0603]
R411  10K  [RES 0603]
R412  10K  [RES 0603]
R413  100K  [RES 0603]
R414  10K  [RES 0603]
R415  100K  [RES 0603]
SB400  Open  [SB_0603]
SB401  Open  [SB_0603]
SW400  RES_Button  [PTS636SM50JSMTRLFS]
U400  TVC  [DIODES SOT-23-6 W6]
U401  STM32F103CBT6  [TI PQFP-48 PAG0048A]  (parts A,B of 2)
U402  TVC  [SOT95P275X110-6N - duplicate - duplicate]
U403  TVC  [SOT95P275X110-6N - duplicate - duplicate]
Y400  8MHz  [XTAL_ECS-80-10-33-CHN-TR3]

### Ports
RES (bidir, see Main_scheme[1C], Debug_switch[2C]), RX (in, see Main_scheme[1C], Debug_switch[3C]), SWO (bidir, see Main_scheme[1C], Debug_switch[2C]), TCK (bidir, see Main_scheme[1C], Debug_switch[2B]), TMS (bidir, see Main_scheme[1C], Debug_switch[2B]), TX (out, see Main_scheme[1C], Debug_switch[3C])

### Nets
3.3V: C403.1 C404.1 C405.2 C406.2 C407.2 C408.2 C409.2 D401.2 LED401.1(R) Q400.3(C) R403.1 R413.2 SB400.2 SB401.2 U401.1(VBAT) U401.9(VDDA) U401.24(VDD_1) U401.36(VDD_2) U401.48(VDD_3) U402.5(VCC) U403.5(VCC)
5V_USB: D400.2 R400.2
GND: C400.1 C401.1 C402.1 C403.2 C404.2 C405.1 C406.1 C407.1 C408.1 C409.1 C410.1 C411.1 J201.2(GND) J201.5(GND) J201.37(GND) J201.38(GND) J400.6(GND) LED400.2(Catode) R402.1 R405.1 R409.1 R410.1 R411.2 R412.2 R414.2 R415.2 SW400.2 U400.2(GND) U401.8(VSSA) U401.23(VSS_1) U401.35(VSS_2) U401.47(VSS_3) U402.2(GND) U403.2(GND) Y400.2(GND) Y400.4(GND)
Main_debug_RX: U401.13(PA3/RX) ; port RX
Main_debug_TX: U401.12(PA2/TX) ; port TX
Main_RES: U401.18(PB0) ; port RES
Main_SWO: U401.31(PA10) ; port SWO
Main_TCK: U401.15(PA5) U401.26(PB13) ; port TCK
Main_TMS: R408.2 U401.27(PB14) ; port TMS
STlink_BOOT0: R415.1 SB401.1 U401.20(PB2/BOOT1)
STlink_BOOT1: R414.1 SB400.1 U401.44(BOOT0)
STlink_LED: R406.2 R407.2 U401.30(PA9)
STlink_N: J201.3(DN) U400.3(IN2) U400.4(IN2) U401.32(PA11/USB_DM)
STlink_P: J201.4(DP) R404.1 U400.1(IN1) U400.6(IN1) U401.33(PA12/USB_DP)
STlink_reset: C402.2 J400.5(RST) R413.1 SW400.1 U401.7(NRST) U403.3(IN2) U403.4(IN2)
STlink_SWO: J400.4(SWO) U401.39(PB3/SWO) U403.1(IN1) U403.6(IN1)
STlink_TCK: J400.2(TCK) U401.37(PA14/TCK) U402.3(IN2) U402.4(IN2)
STlink_TMS: J400.3(TMS) U401.34(PA13/TMS) U402.1(IN1) U402.6(IN1)
STlink_USB_renum: R401.1 U401.38(PA15/USB_REN)
NetC400_2: C400.2 C401.2 D400.1 J201.1(VCC) J201.6(VCC) J201.35(VCC) J201.40(VCC) U400.5(VCC)
NetC410_2: C410.2 U401.5(PD0-OSC_IN) Y400.1
NetC411_2: C411.2 U401.6(PD1-OSC_OUT) Y400.3
NetD401_1: D401.1 J400.1(VCC)
NetJ201_36: J201.36(CC1) R409.2
NetJ201_39: J201.39(CC2) R410.2
NetLED400_1: LED400.1(R) R406.1
NetLED401_2: LED401.2(Catode) R407.1
NetQ400_1: Q400.1(B) R400.1 R401.2 R402.2
NetQ400_2: Q400.2(E) R404.2
NetR403_2: R403.2 R405.2 U401.10(PA0-WKUP)
NetR408_1: R408.1 U401.25(PB12)
NetR411_1: R411.1 U401.3(PC14)
NetR412_1: R412.1 U401.2(PC13)

Not connected (* = marked no-connect by the designer): U401 4(PC15-OSC32_OUT) 11(PA1) 14(PA4) 16(PA6) 17(PA7) 19(PB1) 21(PB10) 22(PB11) 28(PB15) 29(PA8) 40(PB4) 41(PB5) 42(PB6) 43(PB7) 45(PB8) 46(PB9)

### Layout directives
differential pair: STlink_N, STlink_P
net class STLink_SWD: STlink_SWO, STlink_TCK, STlink_TMS
net class Main_SWD: Main_SWO, Main_TCK, Main_TMS
net class Main_debug_UART: Main_debug_RX, Main_debug_TX

### Library data of the parts
C400-C411 = Capacitor: SMT Capacitor
  C400: Value: 10uF
  C401 C403-C408: Value: 100nF
  C402: Value: 10nF
  C409: Value: 4.7uF
  C410 C411: Value: 10pF
D400 D401 = Diode: Rectifier Diode
J400 = SWD_connector
LED400 LED401 = LED: MFR Part #: NCD1206B1; Type: Extended; LCSC Part#: C130717; Datasheet: https://datasheet.lcsc.com/lcsc/2008201033_Foshan-NationStar-Optoelectronics-NCD1206B1_C130717.pdf
R400-R415 = Res: Resistor; Ordered by: Subcon; Published: 8-Jun-2000; Revision: July-2002: Re-released for DXP Platform.; Publisher: Altium Limited
  R400 R403 R405 R411 R412 R414: Value: 10K
  R401 R406-R408: Value: 100R
  R402: Value: 36K
  R404: Value: 1.5K
  R409 R410: Value: 5.1K
  R413 R415: Value: 100K
SB400 SB401 = Circuit Breaker: Published: 24-Mar-1999; Revision: July-2002: Re-released for DXP Platform.; Publisher: Altium Limited
U400 = USB_TVC_protection
U401 = CMP-0237-00250-3: ARM Cortex-M3 32-bit MCU, 128 KB Flash, 20 KB Internal RAM, 37 I/Os, 48-pin LQFP, -40 to 85 degC, Tray; Supply Voltage(Vcc) min (V): 2; Operating Frequency(F) (Processor speed) (MHz): 72; A/D Converter: 2x12-bit (10 Channel); FLASH Size (Prog) (kB): 128; Internal RAM Size (kB): 20; I/Os (High Current): 37; ComponentLink2Description: Datasheet; PackageReference: LQFP48; PartNumber: STM32F103CBT6; ComponentLink1Description: Manufacturer URL; DatasheetVersion: Rev. 16; PackageVersion: Rev. 6, 06/2013; Packing: Tray; ComponentLink1URL: http://www.st.com/web/en/home.html; Mounting Technology: Surface Mount; ComponentLink3URL: http://www.st.com/st-web-ui/static/active/en/resource/technical/document/datasheet/DM00058181.pdf; PackageDescription: 48-Pin Low Profile Quad Flat Package, 7 x 7 mm Body, 0.5 mm Pitch; Core: ARM Cortex-M3; ComponentLink3Description: Package Specification; ComponentLink2URL: http://www.st.com/st-web-ui/static/active/en/resource/technical/document/datasheet/CD00161566.pdf
U402 U403 = TVC_protection
Y400 = Crystal 8Mhz: SMT Crystal; Value: 8MHz

## Sheet Sub_MCU.SchDoc
size A4; SheetNumber: 4; SheetTotal: 7
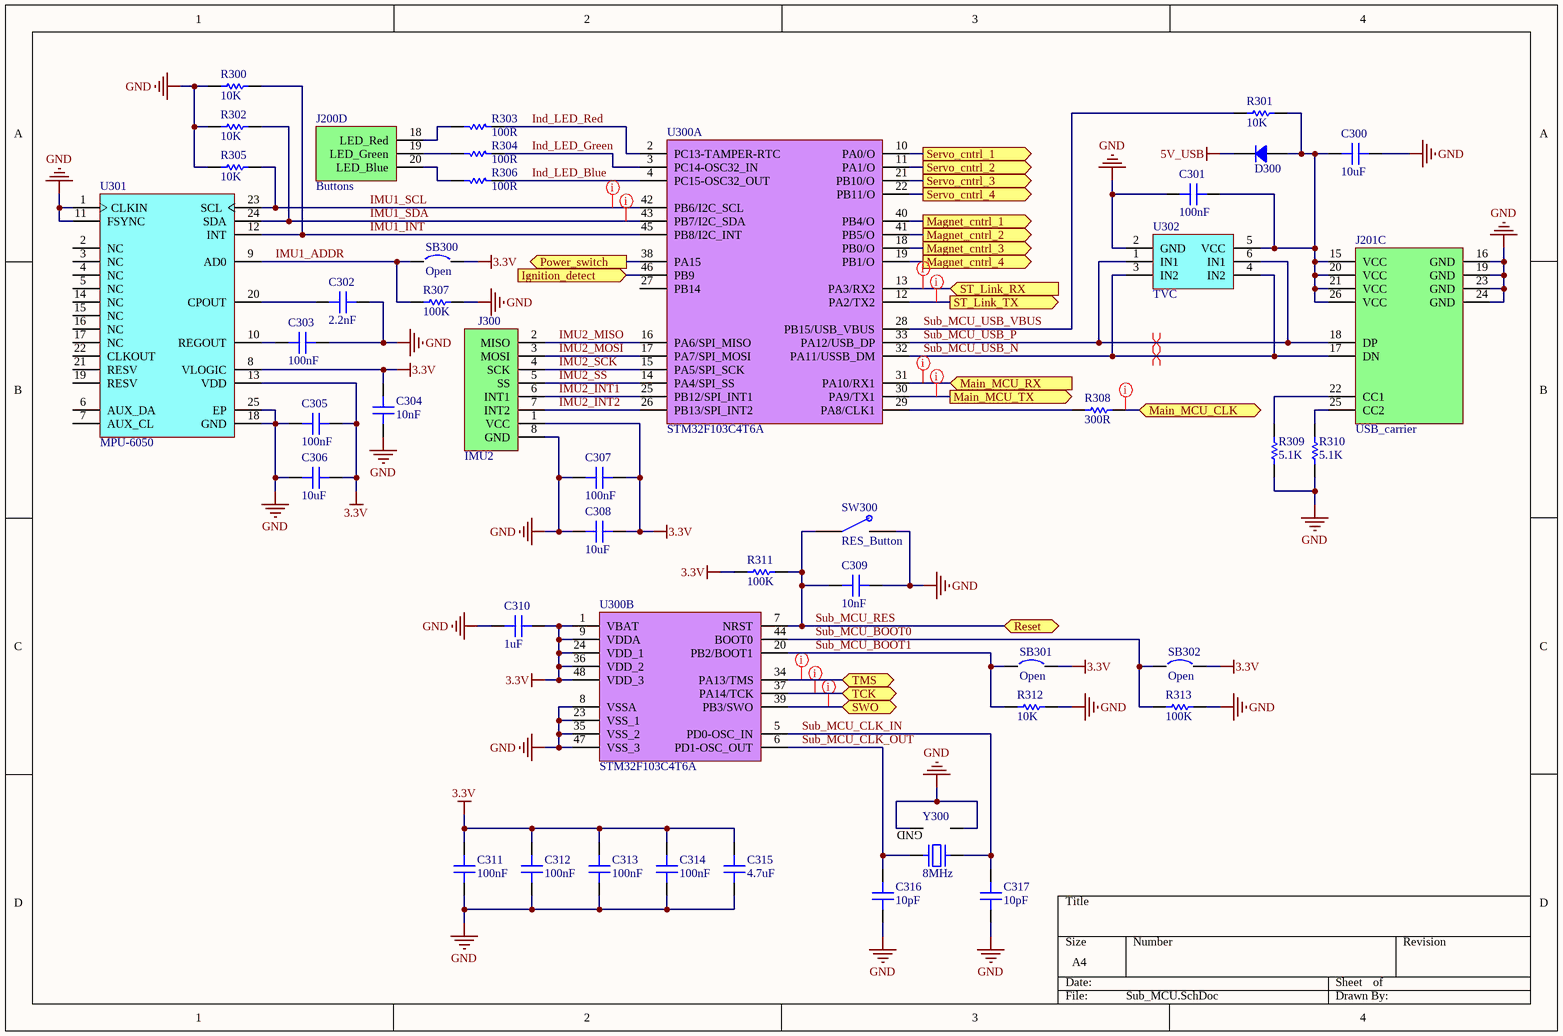
[diagram p5: Sub_MCU.SchDoc]

### Parts
C300  10uF  [CAP 0603]
C301  100nF  [CAP 0603]
C302  2.2nF  [CAP 0603]
C303  100nF  [CAP 0603]
C304  10nF  [CAP 0603]
C305  100nF  [CAP 0603]
C306  10uF  [CAP 0603]
C307  100nF  [CAP 0603]
C308  10uF  [CAP 0603]
C309  10nF  [CAP 0603]
C310  1uF  [CAP 0603]
C311  100nF  [CAP 0603]
C312  100nF  [CAP 0603]
C313  100nF  [CAP 0603]
C314  100nF  [CAP 0603]
C315  4.7uF  [CAP 1206]
C316  10pF  [CAP 0603]
C317  10pF  [CAP 0603]
D300  (no value)  [Bourns DO214AC SMA - duplicate]
J200  Buttons  [2167010409]  (part D of 6)
J201  USB_carrier  [2167010409]  (part C of 4)
J300  IMU2  [SAMTEC_DWM-08-X-X-S-X]
R300  10K  [RES 0603]
R301  10K  [RES 0603]
R302  10K  [RES 0603]
R303  100R  [RES 0603]
R304  100R  [RES 0603]
R305  10K  [RES 0603]
R306  100R  [RES 0603]
R307  100K  [RES 0603]
R308  300R  [RES 0603]
R309  5.1K  [RES 0603]
R310  5.1K  [RES 0603]
R311  100K  [RES 0603]
R312  10K  [RES 0603]
R313  100K  [RES 0603]
SB300  Open  [SB_0603]
SB301  Open  [SB_0603]
SB302  Open  [SB_0603]
SW300  RES_Button  [PTS636SM50JSMTRLFS]
U300  STM32F103C4T6A  [TI PQFP-48 PAG0048A]  (parts A,B of 2)
U301  MPU-6050  [IS-QFN-24_V]
U302  TVC  [DIODES SOT-23-6 W6]
Y300  8MHz  [XTAL_ECS-80-10-33-CHN-TR3]

### Ports
Ignition_detect (in, see Main_scheme[3A], Power[3A]), Magnet_cntrl_1 (out, see Main_scheme[3A]), Magnet_cntrl_2 (out, see Main_scheme[3B]), Magnet_cntrl_3 (out, see Main_scheme[3C]), Magnet_cntrl_4 (out, see Main_scheme[3C]), Main_MCU_CLK (bidir, see Main_scheme[3A]), Main_MCU_RX (in, see Main_scheme[3A]), Main_MCU_TX (out, see Main_scheme[3A]), Power_switch (out, see Main_scheme[3A], Power[4C]), Reset (bidir, see Main_scheme[3D]), Servo_cntrl_1 (out, see Main_scheme[3A]), Servo_cntrl_2 (out, see Main_scheme[3B]), Servo_cntrl_3 (out, see Main_scheme[3B]), Servo_cntrl_4 (out, see Main_scheme[3C]), ST_Link_RX (in, see Main_scheme[3D]), ST_Link_TX (out, see Main_scheme[3D]), SWO (bidir, see Main_scheme[3D]), TCK (bidir, see Main_scheme[3C]), TMS (bidir, see Main_scheme[3D])

### Nets
3.3V: C304.1 C305.2 C306.2 C307.2 C308.2 C310.2 C311.2 C312.2 C313.2 C314.2 C315.2 J300.1(VCC) R311.2 SB300.2 SB301.2 SB302.2 U300.1(VBAT) U300.9(VDDA) U300.24(VDD_1) U300.36(VDD_2) U300.48(VDD_3) U301.8(VLOGIC) U301.13(VDD)
5V_USB: D300.2
GND: C300.2 C301.1 C302.2 C303.2 C304.2 C305.1 C306.1 C307.1 C308.1 C309.1 C310.1 C311.1 C312.1 C313.1 C314.1 C315.1 C316.1 C317.1 J201.16(GND) J201.19(GND) J201.23(GND) J201.24(GND) J300.8(GND) R300.2 R302.2 R305.2 R307.1 R309.1 R310.1 R312.1 R313.1 SW300.2 U300.8(VSSA) U300.23(VSS_1) U300.35(VSS_2) U300.47(VSS_3) U301.1(CLKIN) U301.11(FSYNC) U301.18(GND) U301.25(EP) U302.2(GND) Y300.2(GND) Y300.4(GND)
Ignition_detect: U300.46(PB9) ; port Ignition_detect
IMU1_ADDR: R307.2 SB300.1 U301.9(AD0)
IMU1_INT: R300.1 U300.45(PB8/I2C_INT) U301.12(INT)
IMU1_SCL: R305.1 U300.42(PB6/I2C_SCL) U301.23(SCL)
IMU1_SDA: R302.1 U300.43(PB7/I2C_SDA) U301.24(SDA)
IMU2_INT1: J300.6(INT1) U300.25(PB12/SPI_INT1)
IMU2_INT2: J300.7(INT2) U300.26(PB13/SPI_INT2)
IMU2_MISO: J300.2(MISO) U300.16(PA6/SPI_MISO)
IMU2_MOSI: J300.3(MOSI) U300.17(PA7/SPI_MOSI)
IMU2_SCK: J300.4(SCK) U300.15(PA5/SPI_SCK)
IMU2_SS: J300.5(SS) U300.14(PA4/SPI_SS)
Ind_LED_Blue: R306.2 U300.4(PC15-OSC32_OUT)
Ind_LED_Green: R304.2 U300.3(PC14-OSC32_IN)
Ind_LED_Red: R303.2 U300.2(PC13-TAMPER-RTC)
Power_switch: U300.38(PA15) ; port Power_switch
Sub_MCU_BOOT0: R313.2 SB302.1 U300.44(BOOT0)
Sub_MCU_BOOT1: R312.2 SB301.1 U300.20(PB2/BOOT1)
Sub_MCU_CLK: R308.1 ; port Main_MCU_CLK
Sub_MCU_CLK_IN: C317.2 U300.5(PD0-OSC_IN) Y300.3
Sub_MCU_CLK_OUT: C316.2 U300.6(PD1-OSC_OUT) Y300.1
Sub_MCU_debug_RX: U300.13(PA3/RX2) ; port ST_Link_RX
Sub_MCU_debug_TX: U300.12(PA2/TX2) ; port ST_Link_TX
Sub_MCU_RES: C309.2 R311.1 SW300.1 U300.7(NRST) ; port Reset
Sub_MCU_RX: U300.30(PA9/TX1) ; port Main_MCU_TX
Sub_MCU_SWO: U300.39(PB3/SWO) ; port SWO
Sub_MCU_TCK: U300.37(PA14/TCK) ; port TCK
Sub_MCU_TMS: U300.34(PA13/TMS) ; port TMS
Sub_MCU_TX: U300.31(PA10/RX1) ; port Main_MCU_RX
Sub_MCU_USB_N: J201.17(DN) U300.32(PA11/USSB_DM) U302.3(IN2) U302.4(IN2)
Sub_MCU_USB_P: J201.18(DP) U300.33(PA12/USB_DP) U302.1(IN1) U302.6(IN1)
Sub_MCU_USB_VBUS: R301.2 U300.28(PB15/USB_VBUS)
NetC300_1: C300.1 C301.2 D300.1 J201.15(VCC) J201.20(VCC) J201.21(VCC) J201.26(VCC) R301.1 U302.5(VCC)
NetC302_1: C302.1 U301.20(CPOUT)
NetC303_1: C303.1 U301.10(REGOUT)
NetIC601_1_2: U300.10(PA0/O) ; port Servo_cntrl_1
NetIC601_2_2: U300.11(PA1/O) ; port Servo_cntrl_2
NetIC601_3_2: U300.21(PB10/O) ; port Servo_cntrl_3
NetIC601_4_2: U300.22(PB11/O) ; port Servo_cntrl_4
NetJ200_18: J200.18(LED_Red) R303.1
NetJ200_19: J200.19(LED_Green) R304.1
NetJ200_20: J200.20(LED_Blue) R306.1
NetJ201_22: J201.22(CC1) R309.2
NetJ201_25: J201.25(CC2) R310.2
NetR308_2: R308.2 U300.29(PA8/CLK1)
NetU300_18: U300.18(PB0/O) ; port Magnet_cntrl_3
NetU300_19: U300.19(PB1/O) ; port Magnet_cntrl_4
NetU300_40: U300.40(PB4/O) ; port Magnet_cntrl_1
NetU300_41: U300.41(PB5/O) ; port Magnet_cntrl_2

Not connected (* = marked no-connect by the designer): U300 27(PB14); U301 2(NC) 3(NC) 4(NC) 5(NC) 6(AUX_DA) 7(AUX_CL) 14(NC) 15(NC) 16(NC) 17(NC) 19(RESV) 21(RESV) 22(CLKOUT)

### Layout directives
differential pair: Sub_MCU_USB_N, Sub_MCU_USB_P
net class Sum_MCU_SWD: Sub_MCU_SWO, Sub_MCU_TCK, Sub_MCU_TMS
net class Main_MCU_to SUB_MCU: Sub_MCU_CLK, Sub_MCU_RX, Sub_MCU_TX
net class ub_MCU_UART: Sub_MCU_debug_RX, Sub_MCU_debug_TX
net class I2C: IMU1_SCL, IMU1_SDA

### Library data of the parts
C300-C317 = Capacitor: SMT Capacitor
  C300 C306 C308: Value: 10uF
  C301 C303 C305 C307 C311-C314: Value: 100nF
  C302: Value: 2.2nF
  C304 C309: Value: 10nF
  C310: Value: 1uF
  C315: Value: 4.7uF
  C316 C317: Value: 10pF
D300 = Diode: Rectifier Diode
J200 = AUX_carrier
J300 = IMU_connector
R300-R313 = Res: Resistor; Ordered by: Subcon; Published: 8-Jun-2000; Revision: July-2002: Re-released for DXP Platform.; Publisher: Altium Limited
  R300-R302 R305 R312: Value: 10K
  R303 R304 R306: Value: 100R
  R307 R311 R313: Value: 100K
  R308: Value: 300R
  R309 R310: Value: 5.1K
SB300-SB302 = Circuit Breaker: Published: 24-Mar-1999; Revision: July-2002: Re-released for DXP Platform.; Publisher: Altium Limited
U300 = CMP-0237-00255-3: ARM Cortex-M3 32-bit MCU, 16 KB Flash, 6 KB Internal RAM, 37 I/Os, 48-pin LQFP, -40 to 85 degC, Tray; Operating Frequency(F) (Processor speed) (MHz): 72; Supply Voltage(Vcc) min (V): 2; FLASH Size (Prog) (kB): 16; A/D Converter: 2x12-bit (10 Channel); I/Os (High Current): 37; Internal RAM Size (kB): 6; ComponentLink1Description: Manufacturer URL; PartNumber: STM32F103C4T6A; ComponentLink2URL: http://www.st.com/st-web-ui/static/active/en/resource/technical/document/datasheet/CD00210843.pdf; PackageVersion: Rev. 6, 06/2013; ComponentLink2Description: Datasheet; Core: ARM Cortex-M3; ComponentLink3URL: http://www.st.com/st-web-ui/static/active/en/resource/technical/document/datasheet/DM00058181.pdf; PackageDescription: 48-Pin Low Profile Quad Flat Package, 7 x 7 mm Body, 0.5 mm Pitch; ComponentLink1URL: http://www.st.com/web/en/home.html; Packing: Tray; Mounting Technology: Surface Mount; PackageReference: LQFP48; ComponentLink3Description: Package Specification; DatasheetVersion: Rev. 6
U301 = CMP-1753-00002-2: 3-Axis Gyroscope, Accelerometer and a Digital Motion Processor(TM) (DMP), 2.375 to 3.46 V, -40 to 85 degC, 24-Pin QFN, RoHS, Tape and Reel; Manufacturer: InvenSense; Featured Product: MPU-60506-Axis,IntegratedI²CSolution; Other Names: 1428-1007-2 / MPU6050; Sensor Type: MotionTracking; Online Catalog: MPU-6000™Series; Unit PriceUSD: Digital; Datasheet Version: Rev. 3.3, 05/2012; Category: Sensors,Transducers; Datasheet URL: http://datasheet.octopart.com/MPU-6050-InvenSense-datasheet-14421344.pdf; Family: Multifunction; Standard Package: 5,000; Manufacturer URL: http://www.invensense.com/; Output Type: Digital; Dynamic Catalog: MPU-6000™Series
U302 = USB_TVC_protection
Y300 = Crystal 8Mhz: SMT Crystal; Value: 8MHz

## Sheet Power.SchDoc
size A4; SheetNumber: 2; SheetTotal: 7
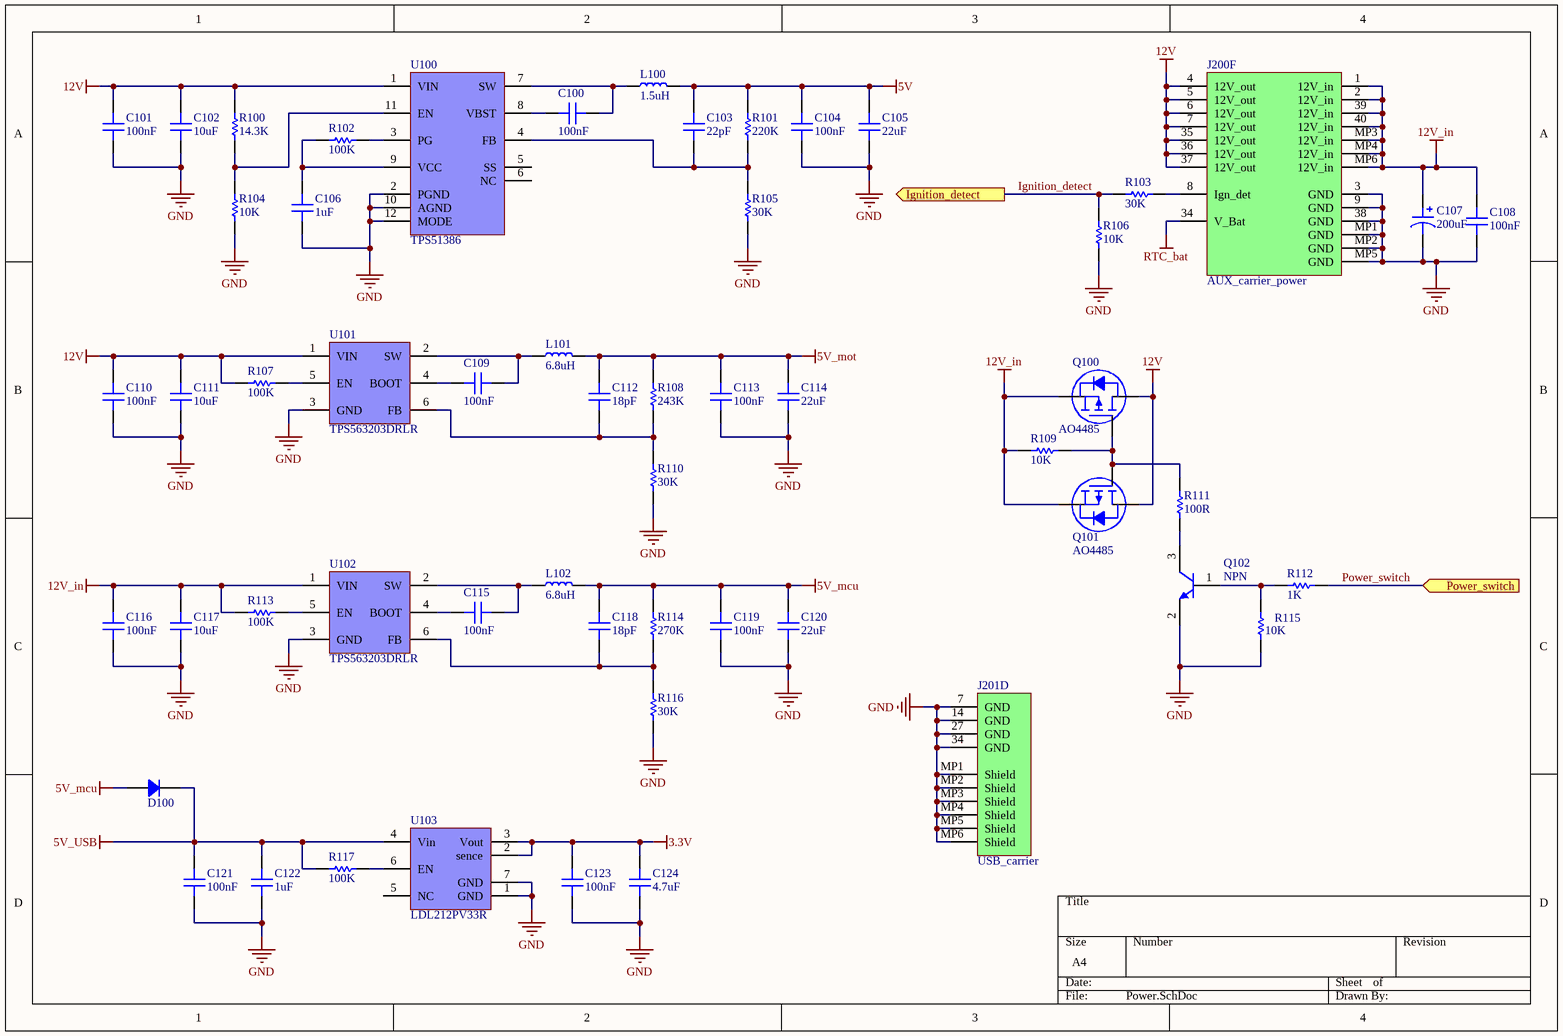
[diagram p6: Power.SchDoc]

### Parts
C100  100nF  [CAP 0603]
C101  100nF  [CAP 0603]
C102  10uF  [CAP 1206]
C103  22pF  [CAP 0603]
C104  100nF  [CAP 0603]
C105  22uF  [CAP 1206]
C106  1uF  [CAP 0603]
C107  200uF  [CAP ALSMD ELEC 6.6MM H5.7MM]
C108  100nF  [CAP 0603]
C109  100nF  [CAP 0603]
C110  100nF  [CAP 0603]
C111  10uF  [CAP 1206]
C112  18pF  [CAP 0603]
C113  100nF  [CAP 0603]
C114  22uF  [CAP 1206]
C115  100nF  [CAP 0603]
C116  100nF  [CAP 0603]
C117  10uF  [CAP 1206]
C118  18pF  [CAP 0603]
C119  100nF  [CAP 0603]
C120  22uF  [CAP 1206]
C121  100nF  [CAP 0603]
C122  1uF  [CAP 0603]
C123  100nF  [CAP 0603]
C124  4.7uF  [CAP 1206]
D100  (no value)  [Bourns DO214AC SMA - duplicate]
J200  AUX_carrier_power  [2167010409]  (part F of 6)
J201  USB_carrier  [2167010409]  (part D of 4)
L100  1.5uH  [IND 0806_2016]
L101  6.8uH  [IND 0806_2016]
L102  6.8uH  [IND 0806_2016]
Q100  AO4485  [ALPHAOMEGA SO8 SOP-8L AO4485]
Q101  AO4485  [ALPHAOMEGA SO8 SOP-8L AO4485]
Q102  NPN  [SOT-23]
R100  14.3K  [RES 0603]
R101  220K  [RES 0603]
R102  100K  [RES 0603]
R103  30K  [RES 0603]
R104  10K  [RES 0603]
R105  30K  [RES 0603]
R106  10K  [RES 0603]
R107  100K  [RES 0603]
R108  243K  [RES 0603]
R109  10K  [RES 0603]
R110  30K  [RES 0603]
R111  100R  [RES 0603]
R112  1K  [RES 0603]
R113  100K  [RES 0603]
R114  270K  [RES 0603]
R115  10K  [RES 0603]
R116  30K  [RES 0603]
R117  100K  [RES 0603]
U100  TPS51386  [VREG_TPS51386RJNR]
U101  TPS563203DRLR  [TI SOT-563 DRL]
U102  TPS563203DRLR  [TI SOT-563 DRL]
U103  LDL212PV33R  [SON50P200X200X80-7N-D]

### Ports
Ignition_detect (out, see Main_scheme[3A], Sub_MCU[2B]), Power_switch (in, see Main_scheme[3A], Sub_MCU[2B])

### Nets
3.3V: C123.2 C124.2 U103.2(sence) U103.3(Vout)
5V: C103.2 C104.2 C105.2 L100.2 R101.2
5V_mcu: C118.2 C119.2 C120.2 D100.1 L102.2 R114.2
5V_mot: C112.2 C113.2 C114.2 L101.2 R108.2
5V_USB: C121.2 C122.2 D100.2 R117.1 U103.4(Vin)
12V: C101.2 C102.2 C110.2 C111.2 J200.4(12V_out) J200.5(12V_out) J200.6(12V_out) J200.7(12V_out) J200.35(12V_out) J200.36(12V_out) J200.37(12V_out) Q100.D Q101.D R100.1 R107.1 U100.1(VIN) U101.1(VIN)
12V_in: C107.2 C108.2 C116.2 C117.2 J200.1(12V_in) J200.2(12V_in) J200.39(12V_in) J200.40(12V_in) J200.MP3(12V_in) J200.MP4(12V_in) J200.MP6(12V_in) Q100.S Q101.S R109.2 R113.1 U102.1(VIN)
GND: C101.1 C102.1 C104.1 C105.1 C106.1 C107.1 C108.1 C110.1 C111.1 C113.1 C114.1 C116.1 C117.1 C119.1 C120.1 C121.1 C122.1 C123.1 C124.1 J200.3(GND) J200.9(GND) J200.38(GND) J200.MP1(GND) J200.MP2(GND) J200.MP5(GND) J201.7(GND) J201.14(GND) J201.27(GND) J201.34(GND) J201.MP1(Shield) J201.MP2(Shield) J201.MP3(Shield) J201.MP4(Shield) J201.MP5(Shield) J201.MP6(Shield) Q102.2(E) R104.1 R105.1 R106.2 R110.1 R115.2 R116.1 U100.2(PGND) U100.10(AGND) U100.12(MODE) U101.3(GND) U102.3(GND) U103.1(GND) U103.7(GND)
RTC_bat: J200.34(V_Bat)
Ignition_detect: R103.2 R106.1 ; port Ignition_detect
Power_switch: R112.1 ; port Power_switch
NetC100_1: C100.1 L100.1 U100.7(SW)
NetC100_2: C100.2 U100.8(VBST)
NetC103_1: C103.1 R101.1 R105.2 U100.4(FB)
NetC106_2: C106.2 R102.1 U100.9(VCC)
NetC109_1: C109.1 L101.1 U101.2(SW)
NetC109_2: C109.2 U101.4(BOOT)
NetC112_1: C112.1 R108.1 R110.2 U101.6(FB)
NetC115_1: C115.1 L102.1 U102.2(SW)
NetC115_2: C115.2 U102.4(BOOT)
NetC118_1: C118.1 R114.1 R116.2 U102.6(FB)
NetJ200_8: J200.8(Ign_det) R103.1
NetQ100_G: Q100.G Q101.G R109.1 R111.1
NetQ102_1: Q102.1(B) R112.2 R115.1
NetQ102_3: Q102.3(C) R111.2
NetR100_2: R100.2 R104.2 U100.11(EN)
NetR102_2: R102.2 U100.3(PG)
NetR107_2: R107.2 U101.5(EN)
NetR113_2: R113.2 U102.5(EN)
NetR117_2: R117.2 U103.6(EN)

Not connected (* = marked no-connect by the designer): U100 5(SS) 6(NC); U103 5(NC)

### Library data of the parts
C100-C106 C108-C124 = Capacitor: SMT Capacitor
  C100 C101 C104 C108-C110 C113 C115 C116 C119 C121 C123: Value: 100nF
  C102 C111 C117: Value: 10uF
  C103: Value: 22pF
  C105 C114 C120: Value: 22uF
  C106 C122: Value: 1uF
  C112 C118: Value: 18pF
  C124: Value: 4.7uF
C107 = Capacitor polarized: SMT Polarised Capacitor; Value: 200uF
D100 = Diode: Rectifier Diode
J200 = AUX_carrier
L100-L102 = Inductor: SMT Inductor
  L100: Value: 1.5uH
  L101 L102: Value: 6.8uH
Q100 Q101 = AO4485: MOSFET P-CH 40V 10A 8SOIC; Manufacturer: Alpha & Omega Semiconductor Inc.; Current - Continuous Drain (Id) @ 25°C: 10A (Ta); Drive Voltage (Max Rds On,  Min Rds On): 4.5V, 10V; FET Type: P-Channel; Gate Charge (Qg) (Max) @ Vgs: 55 nC @ 10 V; Input Capacitance (Ciss) (Max) @ Vds: 3000 pF @ 20 V; Power Dissipation (Max): 1.7W (Ta); Rds On (Max) @ Id, Vgs: 15mOhm @ 10A, 10V; Vgs (Max): ±20V; Vgs(th) (Max) @ Id: 2.5V @ 250µA; Part Number: AO4485; ComponentLink1Description: Datasheet; ComponentLink1URL: http://aosmd.com/res/data_sheets/AO4485.pdf; ComponentLink2Description: DigiKey Link; ComponentLink2URL: https://www.digikey.com/en/products/detail/alpha-omega-semiconductor-inc/AO4485/3152385; Drain to Source Voltage (Vdss): 40 V; LastUpdated: 25.09.2022 4:45:44; Lifecycle Status: Active; Minimum Order: 1; Mounting Type: Surface Mount; Operating Temperature: -55°C ~ 150°C (TJ); Package / Case: 8-SOIC (0.154", 3.90mm Width); Packaging: TapeAndReel; Part Status: Active; Price: 0.35; Series: -; Supplier 1: DigiKey; Supplier Part Number 1: 785-1551-1-ND; Supplier Device Package: 8-SOIC; Technology: MOSFET (Metal Oxide)
R100-R117 = Res: Resistor; Ordered by: Subcon; Published: 8-Jun-2000; Revision: July-2002: Re-released for DXP Platform.; Publisher: Altium Limited
  R100: Value: 14.3K
  R101: Value: 220K
  R102 R107 R113 R117: Value: 100K
  R103 R105 R110 R116: Value: 30K
  R104 R106 R109 R115: Value: 10K
  R108: Value: 243K
  R111: Value: 100R
  R112: Value: 1K
  R114: Value: 270K

## Nets that join several sheets
3.3V: Lidar1 (8 pins), Lidar2 (8 pins), Lidar3 (8 pins), Lidar4 (8 pins), Main_MCU (29 pins), Debug_switch (17 pins), ST_LINK (21 pins), Sub_MCU (23 pins), Power (C123.2 C124.2 U103.2 U103.3)
5V: Lidar1 (5 pins), Lidar2 (5 pins), Lidar3 (5 pins), Lidar4 (5 pins), Main_MCU (11 pins), Power (5 pins)
5V_mot: Lidar1 (C602_1.2 C604_1.2 D600_1.2 U600_1.4), Lidar2 (C602_2.2 C604_2.2 D600_2.2 U600_2.4), Lidar3 (C602_3.2 C604_3.2 D600_3.2 U600_3.4), Lidar4 (C602_4.2 C604_4.2 D600_4.2 U600_4.4), Power (5 pins)
5V_USB: Main_MCU (D201.2), ST_LINK (D400.2 R400.2), Sub_MCU (D300.2), Power (5 pins)
12V: Lidar1 (5 pins), Lidar2 (5 pins), Lidar3 (5 pins), Lidar4 (5 pins), Power (17 pins)
GND: Lidar1 (30 pins), Lidar2 (30 pins), Lidar3 (30 pins), Lidar4 (30 pins), Main_MCU (42 pins), Debug_switch (20 pins), ST_LINK (36 pins), Sub_MCU (43 pins), Power (49 pins)
RTC_bat: Main_MCU (D202.1), Power (J200.34)
Connect_det_1: Lidar1 (IC600_1.2 R600_1.1), Main_MCU (U200.22)
Connect_det_2: Lidar2 (IC600_2.2 R600_2.1), Main_MCU (U200.25)
Connect_det_3: Lidar3 (IC600_3.2 R600_3.1), Main_MCU (U200.8)
Connect_det_4: Lidar4 (IC600_4.2 R600_4.1), Main_MCU (U200.51)
Connect_LED_1: Lidar1 (R606_1.2), Main_MCU (U200.20)
Connect_LED_2: Lidar2 (R606_2.2), Main_MCU (U200.23)
Connect_LED_3: Lidar3 (R606_3.2), Main_MCU (U200.9)
Connect_LED_4: Lidar4 (R606_4.2), Main_MCU (U200.42)
Ignition_detect: Sub_MCU (U300.46), Power (R103.2 R106.1)
Lidar1_RX: Lidar1 (J600_1.7), Main_MCU (U200.17)
Lidar1_speed: Lidar1 (U600_1.2), Main_MCU (U200.58)
Lidar2_RX: Lidar2 (J600_2.7), Main_MCU (U200.24)
Lidar2_speed: Lidar2 (U600_2.2), Main_MCU (U200.59)
Lidar3_RX: Lidar3 (J600_3.7), Main_MCU (U200.15)
Lidar3_speed: Lidar3 (U600_3.2), Main_MCU (U200.10)
Lidar4_RX: Lidar4 (J600_4.7), Main_MCU (U200.33)
Lidar4_speed: Lidar4 (U600_4.2), Main_MCU (U200.61)
Main_debug_RX: Debug_switch (U506.7), ST_LINK (U401.13)
Main_debug_TX: Debug_switch (U506.8), ST_LINK (U401.12)
Main_MCU_debug_RX: Main_MCU (U200.36), Debug_switch (U506.1)
Main_MCU_debug_TX: Main_MCU (U200.35), Debug_switch (U506.2)
Main_MCU_reset: Main_MCU (C205.1 R213.1 SW200.1 U200.7), Debug_switch (U505.2)
Main_MCU_SWO: Main_MCU (U200.55), Debug_switch (U505.1)
Main_MCU_TCK: Main_MCU (U200.49), Debug_switch (U503.1)
Main_MCU_TMS: Main_MCU (U200.46), Debug_switch (U503.2)
Main_RES: Debug_switch (U504.7), ST_LINK (U401.18)
Main_SWO: Debug_switch (U504.8), ST_LINK (U401.31)
Main_TCK: Debug_switch (U502.8), ST_LINK (U401.15 U401.26)
Main_TMS: Debug_switch (U502.7), ST_LINK (R408.2 U401.27)
NetIC601_1_2: Lidar1 (IC601_1.2 R605_1.2), Sub_MCU (U300.10)
NetIC601_2_2: Lidar2 (IC601_2.2 R605_2.2), Sub_MCU (U300.11)
NetIC601_3_2: Lidar3 (IC601_3.2 R605_3.2), Sub_MCU (U300.21)
NetIC601_4_2: Lidar4 (IC601_4.2 R605_4.2), Sub_MCU (U300.22)
NetU300_18: Lidar3 (U600_3.6), Sub_MCU (U300.18)
NetU300_19: Lidar4 (U600_4.6), Sub_MCU (U300.19)
NetU300_40: Lidar1 (U600_1.6), Sub_MCU (U300.40)
NetU300_41: Lidar2 (U600_2.6), Sub_MCU (U300.41)
Power_switch: Sub_MCU (U300.38), Power (R112.1)
Sub_MCU_CLK: Main_MCU (U200.39), Sub_MCU (R308.1)
Sub_MCU_debug_RX: Debug_switch (U506.3), Sub_MCU (U300.13)
Sub_MCU_debug_TX: Debug_switch (U506.4), Sub_MCU (U300.12)
Sub_MCU_RES: Debug_switch (U505.4), Sub_MCU (C309.2 R311.1 SW300.1 U300.7)
Sub_MCU_RX: Main_MCU (U200.38), Sub_MCU (U300.30)
Sub_MCU_SWO: Debug_switch (U505.3), Sub_MCU (U300.39)
Sub_MCU_TCK: Debug_switch (U503.3), Sub_MCU (U300.37)
Sub_MCU_TMS: Debug_switch (U503.4), Sub_MCU (U300.34)
Sub_MCU_TX: Main_MCU (U200.37), Sub_MCU (U300.31)
Working_LED_1: Lidar1 (R607_1.2), Main_MCU (U200.21)
Working_LED_2: Lidar2 (R607_2.2), Main_MCU (U200.26)
Working_LED_3: Lidar3 (R607_3.2), Main_MCU (U200.11)
Working_LED_4: Lidar4 (R607_4.2), Main_MCU (U200.43)